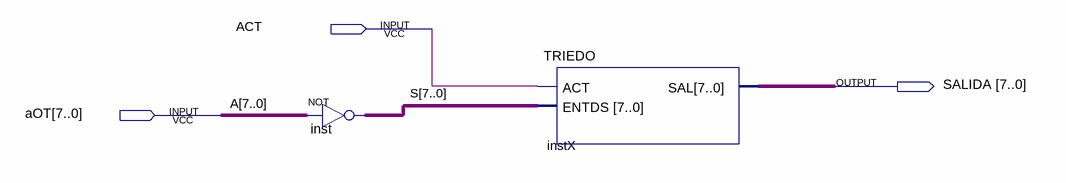
[diagram p0: schematic sheet]
// Quartus schematic F-OT.bdf as structural Verilog: 2 symbols, 3 pins
module \F-OT  (
  input  ACT,
  input  [7:0] aOT,
  output [7:0] SALIDA
);

  wire [7:0] S;

  assign S = ~aOT;  // NOT inst, 8 bits wide
  TRIEDO instX (.ACT(ACT), .ENTDS(S), .SAL(SALIDA));

  // Other names for the same wires on the sheet: A[7:0] = aOT
endmodule
